# EAGLE design key (EAGLE 5.10)
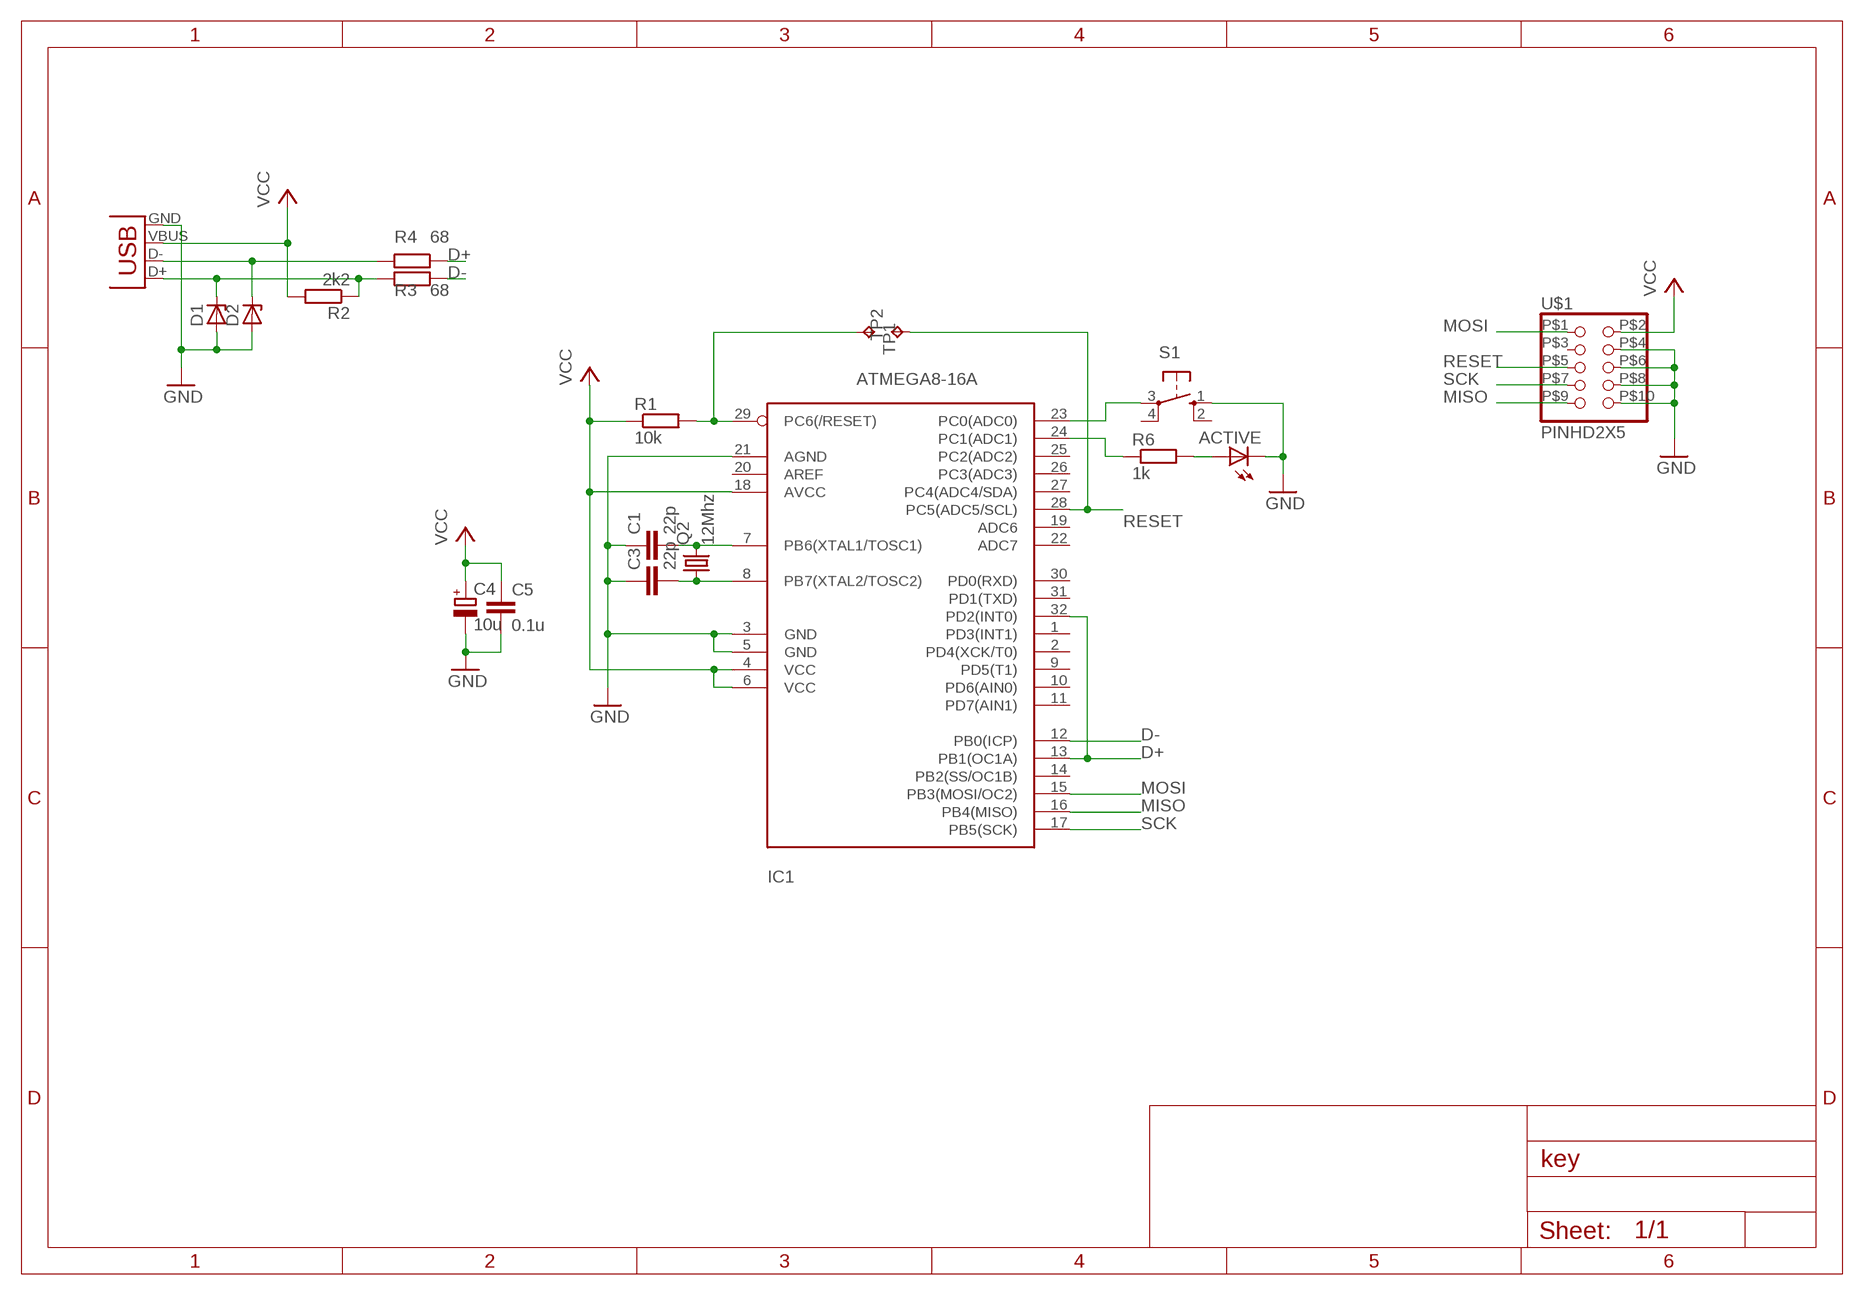
[diagram p0: schematic, sheet 1]

## Parts
ACTIVE  LEDCHIP-LED0805  [CHIP-LED0805]
C1  22p  C-EUC0805  [C0805]
C3  22p  C-EUC0805  [C0805]
C4  10u  CPOL-EUSMCA  [SMC_A]
C5  0.1u  C-EUC0805  [C0805]
D1  ZENER-DIODESOD80C  [SOD80C]
D2  ZENER-DIODESOD80C  [SOD80C]
IC1  ATMEGA8-16A  [TQFP32-08]
Q2  12Mhz  CRYSTALHC49US  [HC49US]
R1  10k  R-EU_M0805  [M0805]
R2  2k2  R-EU_M0805  [M0805]
R3  68  R-EU_M0805  [M0805]
R4  68  R-EU_M0805  [M0805]
R6  1k  R-EU_M0805  [M0805]
S1  10-XX  [B3F-10XX]
TP1  TPTP10SQ  [TP10SQ]
TP2  TPTP10SQ  [TP10SQ]
U$1  PINHD2X5  [PINHD-2X5-LC]
X1  USB-A-LC  [USB-A_LC]

## Nets
D+: IC1.13(PB1(OC1A)) IC1.32(PD2(INT0)) R4.1
D-: IC1.12(PB0(ICP)) R3.1
GND [POWER]: ACTIVE.C C1.1 C3.1 C4.- C5.2 D1.A D2.A IC1.3(GND) IC1.5(GND) IC1.21(AGND) S1.1(S) U$1.P$4 U$1.P$6 U$1.P$8 U$1.P$10 X1.GND
MISO: IC1.16(PB4(MISO)) U$1.P$9
MOSI: IC1.15(PB3(MOSI/OC2)) U$1.P$1
N$1: C1.2 IC1.7(PB6(XTAL1/TOSC1)) Q2.2
N$2: C3.2 IC1.8(PB7(XTAL2/TOSC2)) Q2.1
N$4: IC1.24(PC1(ADC1)) R6.1
N$6: D2.C R4.2 X1.D-
N$7: D1.C R2.1 R3.2 X1.D+
N$8: ACTIVE.A R6.2
N$9: IC1.23(PC0(ADC0)) S1.3(P)
RESET: IC1.28(PC5(ADC5/SCL)) TP2.TP U$1.P$5
SCK: IC1.17(PB5(SCK)) U$1.P$7
SELFPROG: IC1.29(PC6(/RESET)) R1.2 TP1.TP
VCC [POWER]: C4.+ C5.1 IC1.4(VCC) IC1.6(VCC) IC1.18(AVCC) R1.1 R2.2 U$1.P$2 X1.VBUS
Unconnected: IC1.1(PD3(INT1)) IC1.2(PD4(XCK/T0)) IC1.9(PD5(T1)) IC1.10(PD6(AIN0)) IC1.11(PD7(AIN1)) IC1.14(PB2(SS/OC1B)) IC1.19(ADC6) IC1.20(AREF) IC1.22(ADC7) IC1.25(PC2(ADC2)) IC1.26(PC3(ADC3)) IC1.27(PC4(ADC4/SDA)) IC1.30(PD0(RXD)) IC1.31(PD1(TXD)) S1.2(S1) S1.4(P1) U$1.P$3

## Library data of the parts
ACTIVE = led:LED: LED OSRAM: - CHIPLED LG R971, LG N971, LY N971, LG Q971, LY Q971, LO R971, LY R971 LH N974, LH R974 LS Q976, LO Q976, LY Q976 LO Q996 - Hyper CHIPLED LW Q18S LB Q993, LB Q99A, LB R99A - SideLED LS A670, LO A670, LY A670, LG A670, LP A670 LB A673, LV A673, LT A673, LW A673 LH A674 LY A675 LS A676, LA A676, LO A676, LY A676, LW A676 LS A679, LY A679, LG A679 - Hyper Micro SIDELED® LS Y876, LA Y876, LO Y876, LY Y876 LT Y87S - SmartLED LW L88C, LW L88S LB L89C, LB L89S, LG L890 LS L89K, LO L89K, LY L89K LS L896, LA L896, LO L896, LY L896 - TOPLED LS T670, LO T670, LY T670, LG T670, LP T670 LSG T670, LSP T670, LSY T670, LOP T670, LYG T670 LG T671, LOG T671, LSG T671 LB T673, LV T673, LT T673, LW T673 LH T674 LS T676, LA T676, LO T676, LY T676, LB T676, LH T676, LSB T676, LW T676 LB T67C, LV T67C, LT T67C, LS T67K, LO T67K, LY T67K, LW E67C LS E67B, LA E67B, LO E67B, LY E67B, LB E67C, LV E67C, LT E67C LW T67C LS T679, LY T679, LG T679 LS T770, LO T770, LY T770, LG T770, LP T770 LB T773, LV T773, LT T773, LW T773 LH T774 LS E675, LA E675, LY E675, LS T675 LS T776, LA T776, LO T776, LY T776, LB T776 LHGB T686 LT T68C, LB T68C - Hyper Mini TOPLED® LB M676 - Mini TOPLED Santana® LG M470 LS M47K, LO M47K, LY M47K Source: http://www.osram.convergy.de LUXEON: - LUMILED® LXK2-PW12-R00, LXK2-PW12-S00, LXK2-PW14-U00, LXK2-PW14-V00 LXK2-PM12-R00, LXK2-PM12-S00, LXK2-PM14-U00 LXK2-PE12-Q00, LXK2-PE12-R00, LXK2-PE12-S00, LXK2-PE14-T00, LXK2-PE14-U00 LXK2-PB12-K00, LXK2-PB12-L00, LXK2-PB12-M00, LXK2-PB14-N00, LXK2-PB14-P00, LXK2-PB14-Q00 LXK2-PR12-L00, LXK2-PR12-M00, LXK2-PR14-Q00, LXK2-PR14-R00 LXK2-PD12-Q00, LXK2-PD12-R00, LXK2-PD12-S00 LXK2-PH12-R00, LXK2-PH12-S00 LXK2-PL12-P00, LXK2-PL12-Q00, LXK2-PL12-R00 Source: www.luxeon.com KINGBRIGHT: KA-3528ASYC Source: www.kingbright.com
C1 C3 C5 = rcl:C-EU: CAPACITOR, European symbol
C4 = rcl:CPOL-EU: POLARIZED CAPACITOR, European symbol
D1 D2 = diode:ZENER-DIODE: Z-Diode
IC1 = avr:ATMEGA8: MICROCONTROLLER 8 Kbytes FLASH 1 kbytes SRAM 512 bytes EEPROM USART 6-channel 10 bit ADC 2-channel 8 bit ADC
Q2 = sparkfun:CRYSTAL: Crystals Various standard crystals. Proven footprints. Spark Fun Electronics SKU : COM-00534
R1-R4 R6 = rcl:R-EU_: RESISTOR, European symbol
S1 = switch-omron:10-XX: OMRON SWITCH
TP1 TP2 = testpad:TP: Test pad
U$1 = custom:PINHD2X5
X1 = custom:USB: USB Connectors USB-B-PTH is fully proven SKU : PRT-00139 USB-miniB is fully proven SKU : PRT-00587 USB-A-PCB is untested. USB-A-H is throughly reviewed, but untested. Spark Fun Electronics SKU : PRT-00437 USB-B-SMT is throughly reviewed, but untested. Needs silkscreen touching up. USB-A-S has not been used/tested USB-MB-H has not been used/tested

## Net classes
1 POWER: width 0.305 mm

## Board
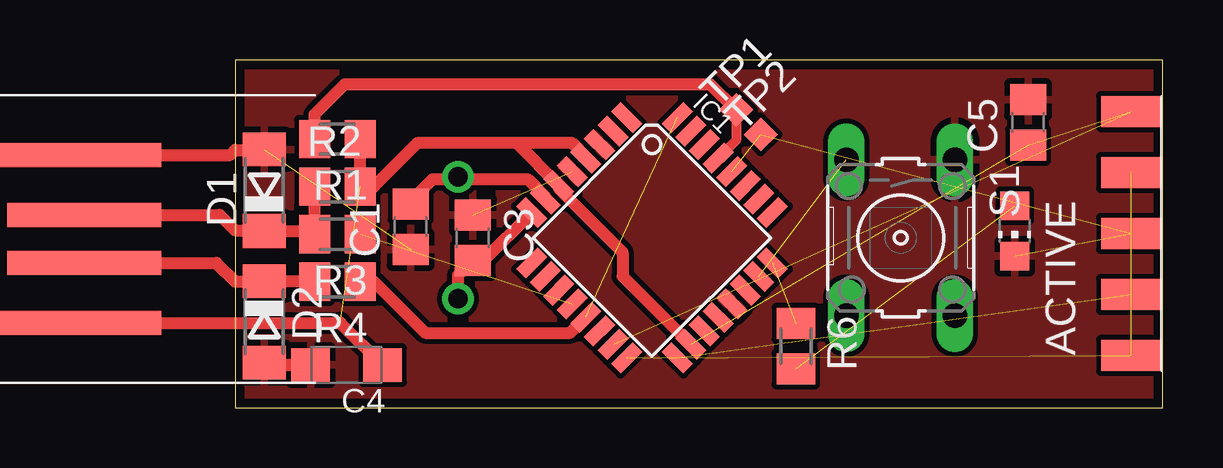
[diagram p1: board, top side]
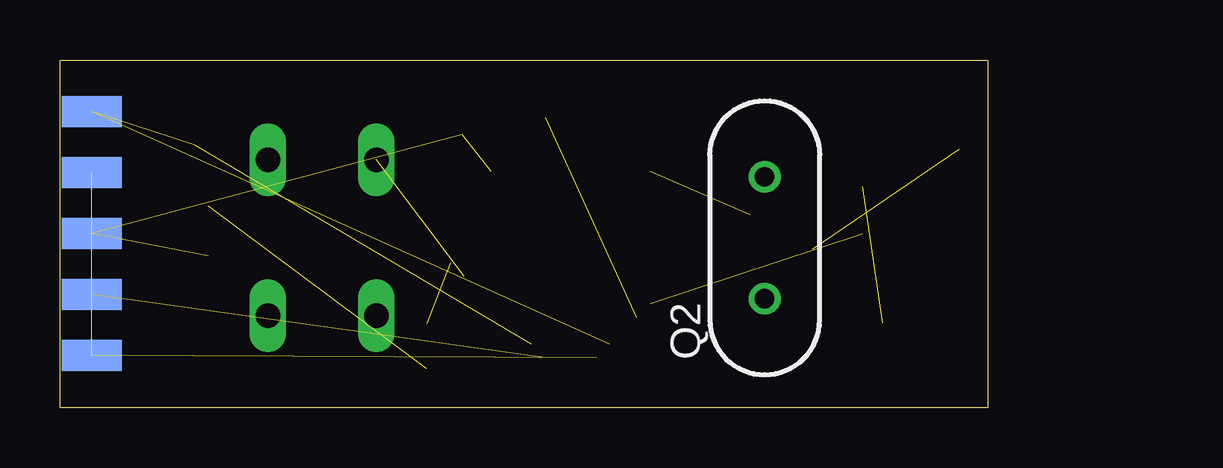
[diagram p2: board, bottom side, seen from below]

Size 38.66 x 14.5 mm. Coordinates in mm from the lower left corner, seen from the top.
Outline: 0,0 38.66,0 38.66,14.5 0,14.5 0,0
Copper layers (1*16): Top 0.035mm / dielectric 1.5mm / Bottom 0.035mm
Design rules "default *": minimum track width 10mil, minimum drill 20mil, track to track 8mil, track to pad 8mil, pad to pad 8mil, via to via 8mil, smd to smd 8mil, copper to edge 15mil, drill to drill 15mil, minimum pad ring 10mil, minimum via ring 8mil, stop-mask expansion 4mil, vias tented up to drill 20mil, thermal gap 10mil

### Footprints (pad centres in the part's own frame; a part is rotated, then mirrored left to right if it is on the bottom)
CHIP-LED0805 = smd 1.2 x 1.2: A 0,-1.05; C 0,1.05
C0805 = smd 1.3 x 1.5: 1 -0.95,0; 2 0.95,0
SMC_A = smd 1.6 x 1.4: + -1.5,0; - 1.5,0
SOD80C = smd 1.4 x 1.8: A 1.7,0; C -1.7,0
TQFP32-08 = smd 1.27 x 0.559: 1 -4.293,2.8; 2 -4.293,2; 3 -4.293,1.2; 4 -4.293,0.4; 5 -4.293,-0.4; 6 -4.293,-1.2; 7 -4.293,-2; 8 -4.293,-2.8; 17 4.293,-2.8; 18 4.293,-2; 19 4.293,-1.2; 20 4.293,-0.4; 21 4.293,0.4; 22 4.293,1.2; 23 4.293,2; 24 4.293,2.8 | smd 0.559 x 1.27: 9 -2.8,-4.293; 10 -2,-4.293; 11 -1.2,-4.293; 12 -0.4,-4.293; 13 0.4,-4.293; 14 1.2,-4.293; 15 2,-4.293; 16 2.8,-4.293; 25 2.8,4.293; 26 2,4.293; 27 1.2,4.293; 28 0.4,4.293; 29 -0.4,4.293; 30 -1.2,4.293; 31 -2,4.293; 32 -2.8,4.293
HC49US = drill 0.813 round: 1 -2.54,0; 2 2.54,0
M0805 = smd 1.3 x 1.6: 1 -0.95,0; 2 0.95,0
B3F-10XX = drill 1.016 long: 1 -3.251,2.261; 2 3.251,2.261; 3 -3.251,-2.261; 4 3.251,-2.261
TP10SQ = smd 1 x 1: TP 0,0
PINHD-2X5-LC = smd 1.3 x 2.5: P$1 7.62,0; P$3 5.08,0; P$5 2.54,0; P$7 0,0; P$9 -2.54,0 | smd 1.3 x 2.5 bottom: P$2 7.62,0; P$4 5.08,0; P$6 2.54,0; P$8 0,0; P$10 -2.54,0
USB-A_LC = smd 6.41 x 1: D+ 5.4,1; D- 5.4,-1 | smd 7.41 x 1: GND 4.9,3.5; VBUS 4.9,-3.5

### Placement (x,y rotation side)
ACTIVE  32.49,7.37 180 top
C1  7.32,7.54 90 top
C3  9.91,7.09 270 top
C4  4.65,1.77 180 top
C5  33.04,11.9 90 top
D1  1.22,9.07 90 top
D2  1.22,3.58 270 top
IC1  17.37,7.09 315 top
Q2  9.3,7.09 90 bottom
R1  4.27,11.2 180 top
R2  4.27,9.22 0 top
R3  4.27,7.24 180 top
R4  4.27,5.26 180 top
R6  23.37,2.57 270 top
S1  27.74,7.09 270 top
TP1  20.88,12.42 45 top
TP2  21.9,11.4 45 top
U$1  37.34,4.72 90 top
X1  -11.68,7.04 0 top  (outside the outline)

### Tracks (layer width: path | path; a pad name or v marks a point on that pad's centre or on a via)
D+  (1 unrouted)
  Top 0.508: R4.1 5.79,5.26 7.92,3.12 13.98,3.12 IC1.13
D-  (1 unrouted)
GND  (6 unrouted)
  Top 0.508: X1.GND -0.21,10.54 0,10.74 1.2,10.74 D1.A | C4.- 1.33,1.77 D2.A
  pour Top (isolate 0.203): 0,14.66 38.66,14.66 38.66,0 0,0
MISO  (1 unrouted)
MOSI  (1 unrouted)
N$1
  Top 0.508: C1.2 7.32,8.61 8.23,9.52 9.2,9.52 Q2.2 9.4,9.52 12.19,9.52 12.92,8.79 IC1.7
N$2
  Top 0.508: Q2.1 9.3,5.53 C3.2 10.35,6.14 IC1.8
N$4  (1 unrouted)
N$6
  Top 0.508: X1.D- -0.78,6.04 0,5.26 1.2,5.26 D2.C 3.29,5.28 R4.2
N$7
  Top 0.508: X1.D+ -0.64,8.04 0,7.39 1.2,7.39 D1.C 3.19,7.37 R3.2 R2.1
N$8  (1 unrouted)
N$9  (1 unrouted)
RESET  (2 unrouted)
SCK  (1 unrouted)
SELFPROG
  Top 0.406: TP1.TP 20.88,11.16 IC1.29
  Top 0.508: R1.2 3.32,12.23 4.57,13.49 19.81,13.49 TP1.TP
VCC  (3 unrouted)
  Top 0.508: X1.VBUS 4.39,3.54 C4.+ | R1.1 R2.2 5.79,9.22 7.62,11.05 11.71,11.05 | 11.71,11.05 IC1.6 13.49,9.14 16.15,6.48 16.15,5.48 IC1.18 | IC1.4 14.62,10.45 14.02,11.05 11.71,11.05

### Text on the board
bSilk: + | -